# EAGLE schematic Chair_test_rev5 (EAGLE 6.5.0)
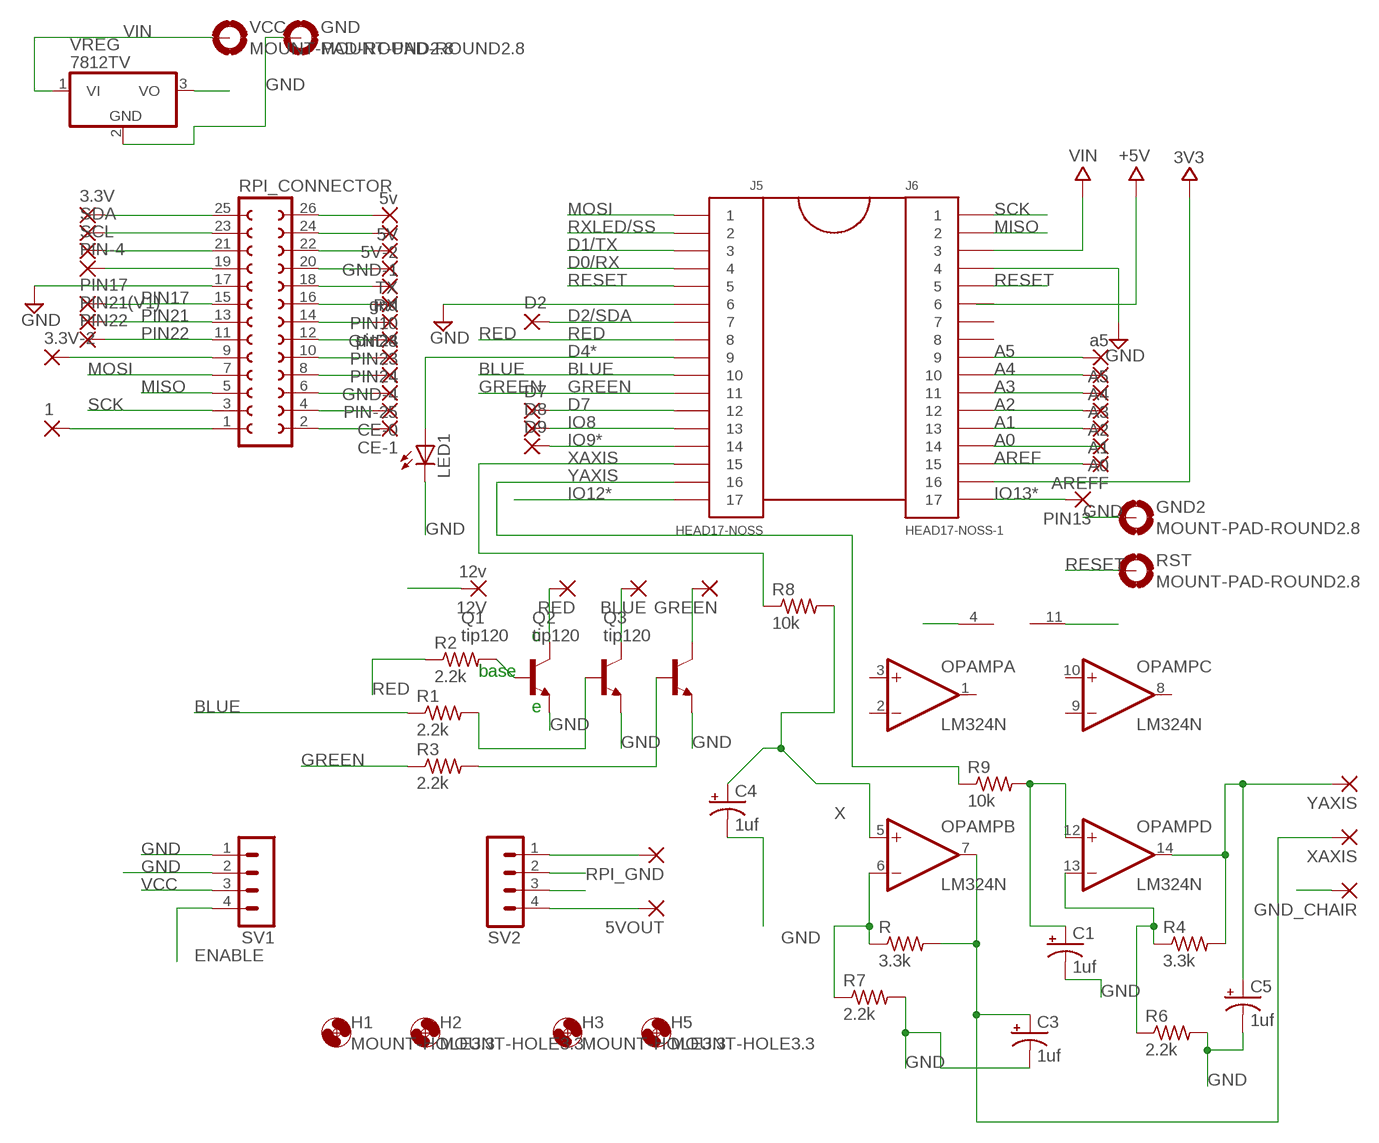
[diagram p0: schematic, sheet 1]

## Parts
1  2,54/1,1  [2,54/1,1]
3.3V  2,54/1,1  [2,54/1,1]
3.3V-2  2,54/1,1  [2,54/1,1]
5V  5v  2,54/1,1  [2,54/1,1]
5V-2  2,54/1,1  [2,54/1,1]
5VOUT  2,54/1,1  [2,54/1,1]
12V  12v  2,54/1,1  [2,54/1,1]
A0  2,54/1,1  [2,54/1,1]
A1  2,54/1,1  [2,54/1,1]
A2  2,54/1,1  [2,54/1,1]
A3  2,54/1,1  [2,54/1,1]
A4  2,54/1,1  [2,54/1,1]
A5  a5  2,54/1,1  [2,54/1,1]
AREFF  2,54/1,1  [2,54/1,1]
BLUE  2,54/1,1  [2,54/1,1]
C1  1uf  CPOL-USE5-10.5  [E5-10,5]
C3  1uf  CPOL-USE5-10.5  [E5-10,5]
C4  1uf  CPOL-USE5-10.5  [E5-10,5]
C5  1uf  CPOL-USE5-10.5  [E5-10,5]
CE-0  2,54/1,1  [2,54/1,1]
CE-1  2,54/1,1  [2,54/1,1]
D2  2,54/1,1  [2,54/1,1]
D7  2,54/1,1  [2,54/1,1]
D8  2,54/1,1  [2,54/1,1]
D9  2,54/1,1  [2,54/1,1]
GND  MOUNT-PAD-ROUND2.8  [2,8-PAD]
GND2  MOUNT-PAD-ROUND2.8  [2,8-PAD]
GND3  gnd  2,54/1,1  [2,54/1,1]
GND-1  2,54/1,1  [2,54/1,1]
GND-4  2,54/1,1  [2,54/1,1]
GND_CHAIR  2,54/1,1  [2,54/1,1]
GREEN  2,54/1,1  [2,54/1,1]
H1  MOUNT-HOLE3.3  [3,3]
H2  MOUNT-HOLE3.3  [3,3]
H3  MOUNT-HOLE3.3  [3,3]
H5  MOUNT-HOLE3.3  [3,3]
J5  HEAD17-NOSS  [HEAD17-NOSS]
J6  HEAD17-NOSS-1  [HEAD17-NOSS-1]
LED1  LED5MM  [LED5MM]
OPAMP  LM324N  [DIL14]
PIN10  2,54/1,1  [2,54/1,1]
PIN13  2,54/1,1  [2,54/1,1]
PIN17  2,54/1,1  [2,54/1,1]
PIN21(V1)  2,54/1,1  [2,54/1,1]
PIN22  2,54/1,1  [2,54/1,1]
PIN23  2,54/1,1  [2,54/1,1]
PIN24  pin24  2,54/1,1  [2,54/1,1]
PIN-4  2,54/1,1  [2,54/1,1]
PIN-25  2,54/1,1  [2,54/1,1]
Q1  tip120  -NPN-TO220V  [TO220V]
Q2  tip120  -NPN-TO220V  [TO220V]
Q3  tip120  -NPN-TO220V  [TO220V]
R  3.3k  R-US_0309/10  [0309/10]
R1  2.2k  R-US_0309/10  [0309/10]
R2  2.2k  R-US_0309/10  [0309/10]
R3  2.2k  R-US_0309/10  [0309/10]
R4  3.3k  R-US_0309/10  [0309/10]
R6  2.2k  R-US_0309/10  [0309/10]
R7  2.2k  R-US_0309/10  [0309/10]
R8  10k  R-US_0309/10  [0309/10]
R9  10k  R-US_0309/10  [0309/10]
RED  2,54/1,1  [2,54/1,1]
RPI_CONNECTOR  FE13-2  [FE13-2]
RPI_GND  2,54/1,1  [2,54/1,1]
RST  MOUNT-PAD-ROUND2.8  [2,8-PAD]
RX  2,54/1,1  [2,54/1,1]
SCL  2,54/1,1  [2,54/1,1]
SDA  2,54/1,1  [2,54/1,1]
SV1  MA04-1  [MA04-1]
SV2  MA04-1  [MA04-1]
TX  2,54/1,1  [2,54/1,1]
VCC  MOUNT-PAD-ROUND2.8  [2,8-PAD]
VREG  7812TV  [TO220V]
XAXIS  2,54/1,1  [2,54/1,1]
YAXIS  2,54/1,1  [2,54/1,1]

## Nets
3V3: J6.16
5V: 5VOUT.1(P) SV2.3 SV2.4
5VGND: RPI_GND.1(P) SV2.1
+5V: J6.6
A0: J6.14
A1: A1.1(P) J6.13
A2: A2.1(P) J6.12
A3: A3.1(P) J6.11
A4: A4.1(P) J6.10
A5: A5.1(P) J6.9
AREF: AREFF.1(P) J6.15
BLUE: J5.10 R1.1
D0/RX: J5.4
D1/TX: J5.3
D2/SDA: D2.1(P) J5.7
D4*: J5.9 LED1.A
D7: D7.1(P) J5.12
ENABLE: SV1.4
GND: C1.- C3.- C4.- C5.- GND2.B2,8(MOUNT) GND3.1(P) GND-1.1(P) GND-4.1(P) GND.B2,8(MOUNT) GND_CHAIR.1(P) J5.6 J6.4 LED1.K(C) OPAMP.11(P:V-) Q1.3(E) Q2.3(E) Q3.3(E) R6.2 R7.2 RPI_CONNECTOR.8 RPI_CONNECTOR.14 RPI_CONNECTOR.17 RPI_CONNECTOR.22 SV1.1 SV1.2 SV2.2 VREG.2(GND)
GREEN: J5.11 R3.1
IO8: D8.1(P) J5.13
IO9*: D9.1(P) J5.14
IO12*: J5.17
IO13*: J6.17 PIN13.1(P)
MISO: J6.2 RPI_CONNECTOR.5
MOSI: J5.1 RPI_CONNECTOR.7
N$1: Q1.1(B) R2.2
N$2: Q3.1(B) R3.2
N$3: Q2.1(B) R1.2
N$4: Q1.2(C) RED.1(P)
N$5: BLUE.1(P) Q2.2(C)
N$6: GREEN.1(P) Q3.2(C)
N$9: 3.3V-2.1(P) RPI_CONNECTOR.9
N$10: C1.+ OPAMP.12(D:+IN) R9.2
N$11: C3.+ OPAMP.7(B:OUT) R.2 XAXIS.1(P)
N$12: OPAMP.6(B:-IN) R7.1 R.1
N$13: C5.+ OPAMP.14(D:OUT) R4.2 YAXIS.1(P)
N$14: OPAMP.13(D:-IN) R4.1 R6.1
N$15: 1.1(P) RPI_CONNECTOR.1
N$16: 3.3V.1(P) RPI_CONNECTOR.25
N$17: RPI_CONNECTOR.23 SDA.1(P)
N$18: RPI_CONNECTOR.21 SCL.1(P)
N$19: PIN-4.1(P) RPI_CONNECTOR.19
N$21: 5V-2.1(P) RPI_CONNECTOR.24
N$23: RPI_CONNECTOR.20 TX.1(P)
N$24: RPI_CONNECTOR.18 RX.1(P)
N$25: PIN10.1(P) RPI_CONNECTOR.16
N$27: PIN23.1(P) RPI_CONNECTOR.12
N$28: PIN24.1(P) RPI_CONNECTOR.10
N$30: PIN-25.1(P) RPI_CONNECTOR.6
N$31: CE-0.1(P) RPI_CONNECTOR.4
N$32: CE-1.1(P) RPI_CONNECTOR.2
NULL: 5V.1(P) RPI_CONNECTOR.26
PIN17: PIN17.1(P) RPI_CONNECTOR.15
PIN21: PIN21(V1).1(P) RPI_CONNECTOR.13
PIN22: PIN22.1(P) RPI_CONNECTOR.11
RED: J5.8 R2.1
RESET: J5.5 J6.5 RST.B2,8(MOUNT)
RXLED/SS: J5.2
SCK: J6.1 RPI_CONNECTOR.3
VCC: 12V.1(P) J6.3 OPAMP.4(P:V+) SV1.3 VREG.3(VO) ; supply symbol labelled VIN
VIN: VCC.B2,8(MOUNT) VREG.1(VI)
X: C4.+ OPAMP.5(B:+IN) R8.2
XAXIS: J5.15 R8.1
YAXIS: J5.16 R9.1
Unconnected: A0.1(P) J6.7 J6.8 OPAMP.1(A:OUT) OPAMP.2(A:-IN) OPAMP.3(A:+IN) OPAMP.8(C:OUT) OPAMP.9(C:-IN) OPAMP.10(C:+IN)

## Notes on the sheet
- c
- base
- e

## Library data of the parts
1 3.3V 3.3V-2 5V 5V-2 5VOUT 12V A0 A1-A5 AREFF BLUE CE-0 CE-1 D2 D7-D9 GND3 GND-1 GND-4 GND_CHAIR GREEN PIN10 PIN13 PIN17 PIN21(V1) PIN22-PIN24 PIN-4 PIN-25 RED RPI_GND RX SCL SDA TX XAXIS YAXIS = wirepad:2,54/1,1: THROUGH-HOLE PAD
C1 C3-C5 = resistor:CPOL-US: POLARIZED CAPACITOR, American symbol
GND GND2 RST VCC = holes:MOUNT-PAD-ROUND: MOUNTING PAD, round
H1-H3 H5 = holes:MOUNT-HOLE: MOUNTING HOLE with drill center marker
J5 = SmartPrj:HEAD17-NOSS
J6 = SmartPrj:HEAD17-NOSS-1
LED1 = led:LED: LED OSRAM: - CHIPLED LG R971, LG N971, LY N971, LG Q971, LY Q971, LO R971, LY R971 LH N974, LH R974 LS Q976, LO Q976, LY Q976 LO Q996 - Hyper CHIPLED LW Q18S LB Q993, LB Q99A, LB R99A - SideLED LS A670, LO A670, LY A670, LG A670, LP A670 LB A673, LV A673, LT A673, LW A673 LH A674 LY A675 LS A676, LA A676, LO A676, LY A676, LW A676 LS A679, LY A679, LG A679 - Hyper Micro SIDELED® LS Y876, LA Y876, LO Y876, LY Y876 LT Y87S - SmartLED LW L88C, LW L88S LB L89C, LB L89S, LG L890 LS L89K, LO L89K, LY L89K LS L896, LA L896, LO L896, LY L896 - TOPLED LS T670, LO T670, LY T670, LG T670, LP T670 LSG T670, LSP T670, LSY T670, LOP T670, LYG T670 LG T671, LOG T671, LSG T671 LB T673, LV T673, LT T673, LW T673 LH T674 LS T676, LA T676, LO T676, LY T676, LB T676, LH T676, LSB T676, LW T676 LB T67C, LV T67C, LT T67C, LS T67K, LO T67K, LY T67K, LW E67C LS E67B, LA E67B, LO E67B, LY E67B, LB E67C, LV E67C, LT E67C LW T67C LS T679, LY T679, LG T679 LS T770, LO T770, LY T770, LG T770, LP T770 LB T773, LV T773, LT T773, LW T773 LH T774 LS E675, LA E675, LY E675, LS T675 LS T776, LA T776, LO T776, LY T776, LB T776 LHGB T686 LT T68C, LB T68C - Hyper Mini TOPLED® LB M676 - Mini TOPLED Santana® LG M470 LS M47K, LO M47K, LY M47K Source: http://www.osram.convergy.de LUXEON: - LUMILED® LXK2-PW12-R00, LXK2-PW12-S00, LXK2-PW14-U00, LXK2-PW14-V00 LXK2-PM12-R00, LXK2-PM12-S00, LXK2-PM14-U00 LXK2-PE12-Q00, LXK2-PE12-R00, LXK2-PE12-S00, LXK2-PE14-T00, LXK2-PE14-U00 LXK2-PB12-K00, LXK2-PB12-L00, LXK2-PB12-M00, LXK2-PB14-N00, LXK2-PB14-P00, LXK2-PB14-Q00 LXK2-PR12-L00, LXK2-PR12-M00, LXK2-PR14-Q00, LXK2-PR14-R00 LXK2-PD12-Q00, LXK2-PD12-R00, LXK2-PD12-S00 LXK2-PH12-R00, LXK2-PH12-S00 LXK2-PL12-P00, LXK2-PL12-Q00, LXK2-PL12-R00 Source: www.luxeon.com KINGBRIGHT: KA-3528ASYC Source: www.kingbright.com
OPAMP = linear:LM324: OP AMP
Q1-Q3 = transistor:*-NPN-: NPN Transistror BF959 corrected 2008.03.06
R R1-R4 R6-R9 = resistor:R-US_: RESISTOR, American symbol
RPI_CONNECTOR = con-lsta:FE13-2: FEMALE HEADER; OC_FARNELL: unknown; OC_NEWARK: unknown
SV1 SV2 = con-lstb:MA04-1: PIN HEADER; OC_FARNELL: unknown; OC_NEWARK: unknown
VREG = linear:78*: Positive VOLTAGE REGULATOR Source: http://cache.national.com/ds/LM/LM78L05.pdf http://www.fairchildsemi.com/ds/LM/LM7805.pdf

## Net classes
0 default: width 0.254 mm, drill 0.61 mm, clearance 0.203 mm